# EAGLE design vfd_dcbus (EAGLE 9.6.1)
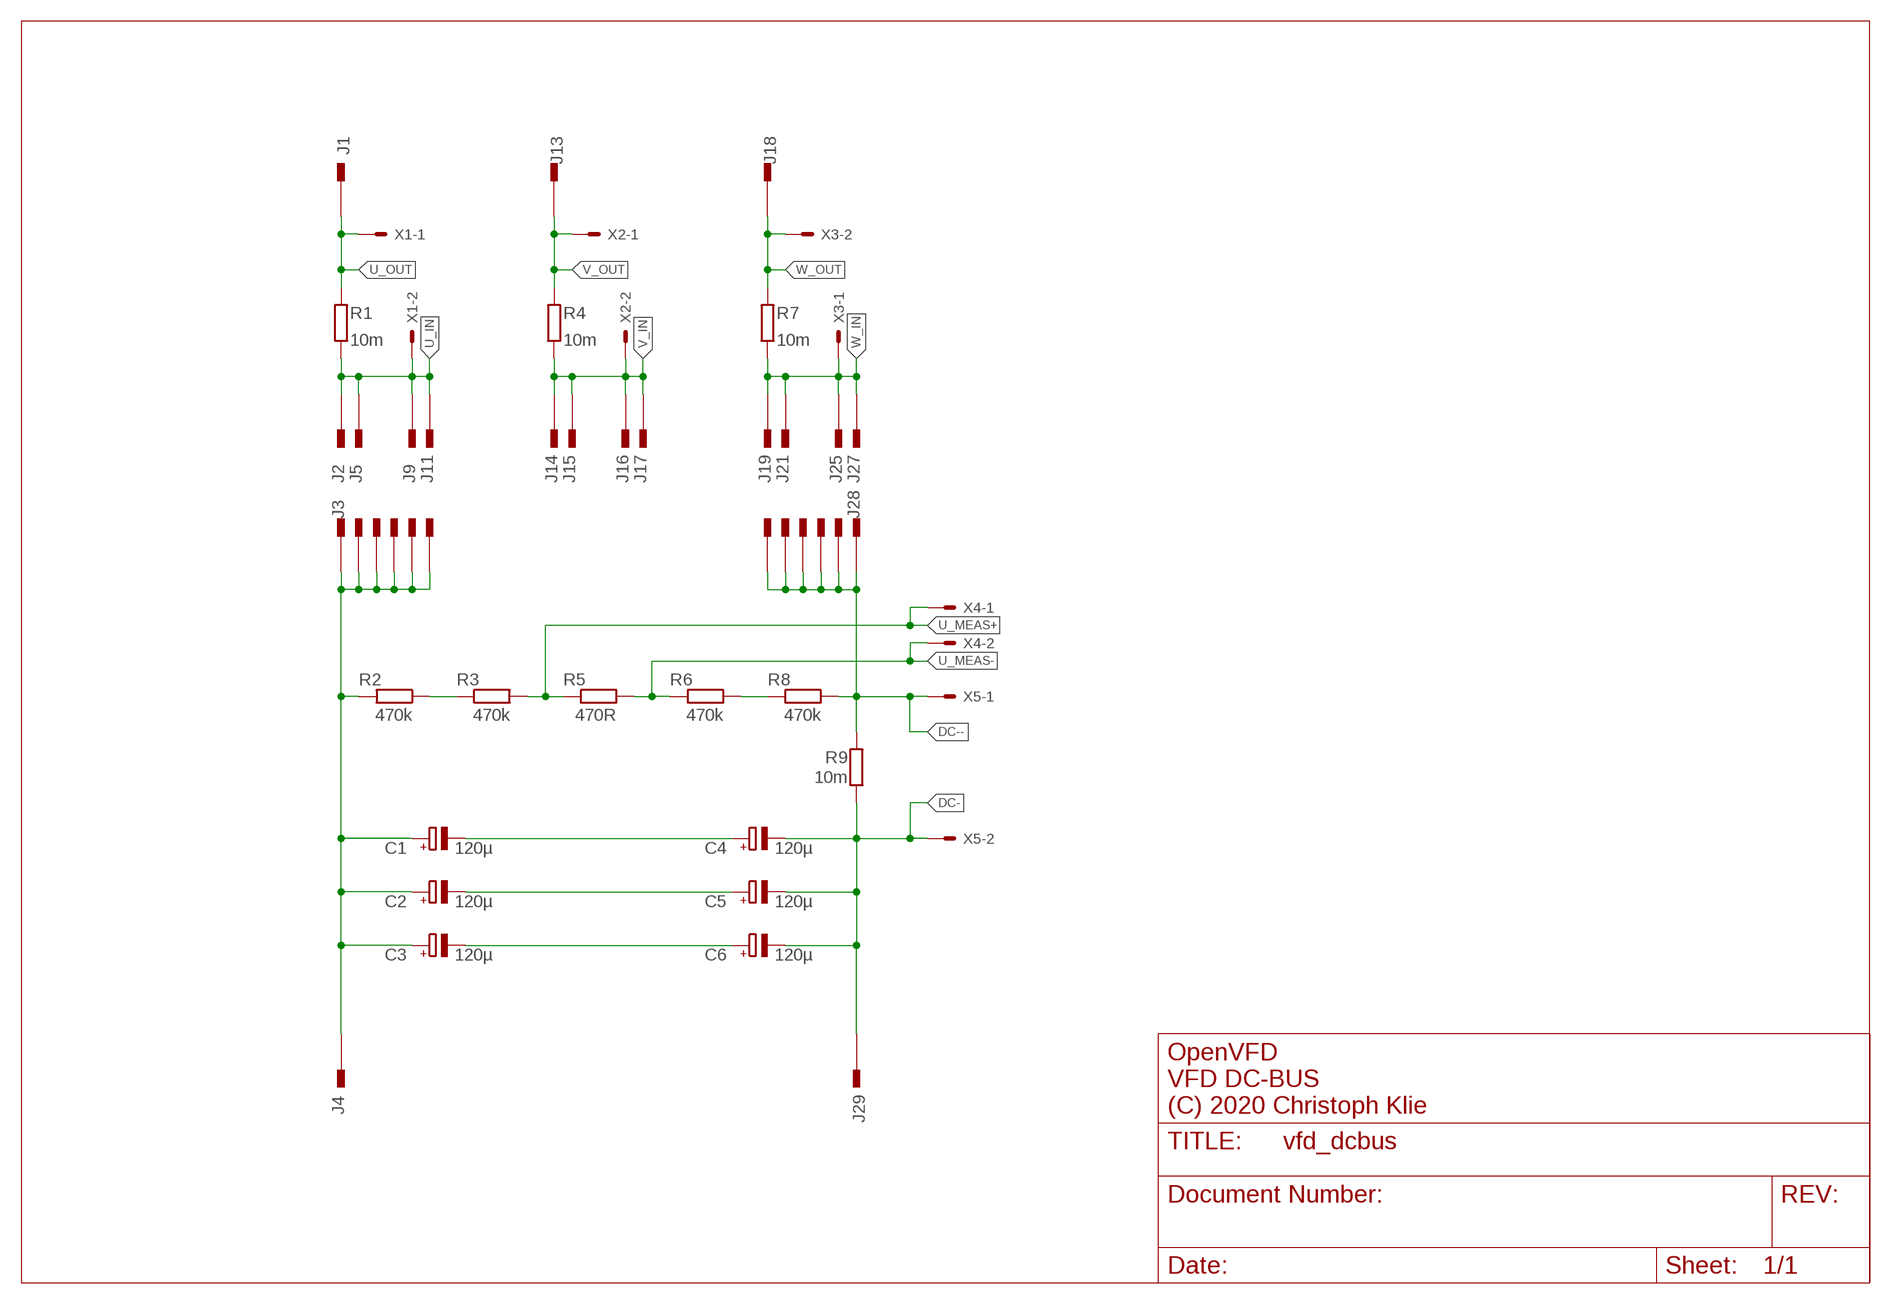
[diagram p0: schematic, sheet 1]

## Parts
C1  120µ  CPOL-EUE10-25  [EB25D]
C2  120µ  CPOL-EUE10-25  [EB25D]
C3  120µ  CPOL-EUE10-25  [EB25D]
C4  120µ  CPOL-EUE10-25  [EB25D]
C5  120µ  CPOL-EUE10-25  [EB25D]
C6  120µ  CPOL-EUE10-25  [EB25D]
J1  PIN2F061.200  [F061.200]
J2  PIN2F061.080  [F061.080]
J3  PIN2F061.080  [F061.080]
J4  PIN2F061.200  [F061.200]
J5  PIN2F061.080  [F061.080]
J6  PIN2F061.080  [F061.080]
J7  PIN2F061.080  [F061.080]
J8  PIN2F061.080  [F061.080]
J9  PIN2F061.080  [F061.080]
J10  PIN2F061.080  [F061.080]
J11  PIN2F061.080  [F061.080]
J12  PIN2F061.080  [F061.080]
J13  PIN2F061.200  [F061.200]
J14  PIN2F061.080  [F061.080]
J15  PIN2F061.080  [F061.080]
J16  PIN2F061.080  [F061.080]
J17  PIN2F061.080  [F061.080]
J18  PIN2F061.200  [F061.200]
J19  PIN2F061.080  [F061.080]
J20  PIN2F061.080  [F061.080]
J21  PIN2F061.080  [F061.080]
J22  PIN2F061.080  [F061.080]
J23  PIN2F061.080  [F061.080]
J24  PIN2F061.080  [F061.080]
J25  PIN2F061.080  [F061.080]
J26  PIN2F061.080  [F061.080]
J27  PIN2F061.080  [F061.080]
J28  PIN2F061.080  [F061.080]
J29  PIN2F061.200  [F061.200]
R1  10m  R-EU_R2512  [R2512]
R2  470k  R-EU_0207/5V  [0207/5V]
R3  470k  R-EU_0207/5V  [0207/5V]
R4  10m  R-EU_R2512  [R2512]
R5  470R  R-EU_R1206  [R1206]
R6  470k  R-EU_0207/5V  [0207/5V]
R7  10m  R-EU_R2512  [R2512]
R8  470k  R-EU_0207/5V  [0207/5V]
R9  10m  R-EU_R2512  [R2512]
X1  JST-XH-02-PIN-LONG-PAD  [JST-XH-02-PACKAGE-LONG-PAD]
X2  JST-XH-02-PIN-LONG-PAD  [JST-XH-02-PACKAGE-LONG-PAD]
X3  JST-XH-02-PIN-LONG-PAD  [JST-XH-02-PACKAGE-LONG-PAD]
X4  JST-XH-02-PIN-LONG-PAD  [JST-XH-02-PACKAGE-LONG-PAD]
X5  JST-XH-02-PIN-LONG-PAD  [JST-XH-02-PACKAGE-LONG-PAD]

## Nets
DC+: C1.+ C2.+ C3.+ J3.1A J3.1B J4.1A J4.1B J6.1A J6.1B J7.1A J7.1B J8.1A J8.1B J10.1A J10.1B J12.1A J12.1B R2.2
DC-: C4.- C5.- C6.- J29.1A J29.1B R9.1 X5.2
DC--: J20.1A J20.1B J22.1A J22.1B J23.1A J23.1B J24.1A J24.1B J26.1A J26.1B J28.1A J28.1B R8.2 R9.2 X5.1
N$1: R2.1 R3.1
N$2: R6.1 R8.1
N$8: C1.- C4.+
N$9: C2.- C5.+
N$10: C3.- C6.+
U_IN: J2.1A J2.1B J5.1A J5.1B J9.1A J9.1B J11.1A J11.1B R1.1 X1.2
U_MEAS+: R3.2 R5.1 X4.1
U_MEAS-: R5.2 R6.2 X4.2
U_OUT: J1.1A J1.1B R1.2 X1.1
V_IN: J14.1A J14.1B J15.1A J15.1B J16.1A J16.1B J17.1A J17.1B R4.1 X2.2
V_OUT: J13.1A J13.1B R4.2 X2.1
W_IN: J19.1A J19.1B J21.1A J21.1B J25.1A J25.1B J27.1A J27.1B R7.1 X3.1
W_OUT: J18.1A J18.1B R7.2 X3.2

## Notes on the sheet
- OpenVFD
- VFD DC-BUS
- (C) 2020 Christoph Klie

## Library data of the parts
C1-C6 = resistor:CPOL-EU: POLARIZED CAPACITOR, European symbol; R: BE LXS 120/450
J1 J4 J13 J18 J29 = con-faston:PIN2: Flachstecker Typ Tyco/Electronics/AMP TAB, FASTON Printed Circuit Board Tabs Source: http://www.buerklin.com, http://catalog.tycoelectronics.com; OC_FARNELL: unknown; OC_NEWARK: unknown; R: VT FS-PW 6,35
J2 J3 J5-J12 J14-J17 J19-J28 = con-faston:PIN2: Flachstecker Typ Tyco/Electronics/AMP TAB, FASTON Printed Circuit Board Tabs Source: http://www.buerklin.com, http://catalog.tycoelectronics.com; OC_FARNELL: unknown; OC_NEWARK: unknown; R: VT FS-P 6,35
R1 R4 R7 R9 = resistor:R-EU_: RESISTOR, European symbol; R: ISA SMT R010-1
R2 R3 R6 R8 = rcl:R-EU_: RESISTOR, European symbol; R: MPR 470K; SPICEPREFIX: R
R5 = rcl:R-EU_: RESISTOR, European symbol; R: SPR-1206 470; SPICEPREFIX: R
X1-X5 =  JST_XH_connnectors:JST-XH-02-PIN: JST XH Connector 2 Pin Wire to board connector. Pitch: 2,54 mm, (0.100") Number of pins: 2 Created by Rembrandt Electronics www.rembrandtelectronics.com; R: JST XH2P ST

## Board
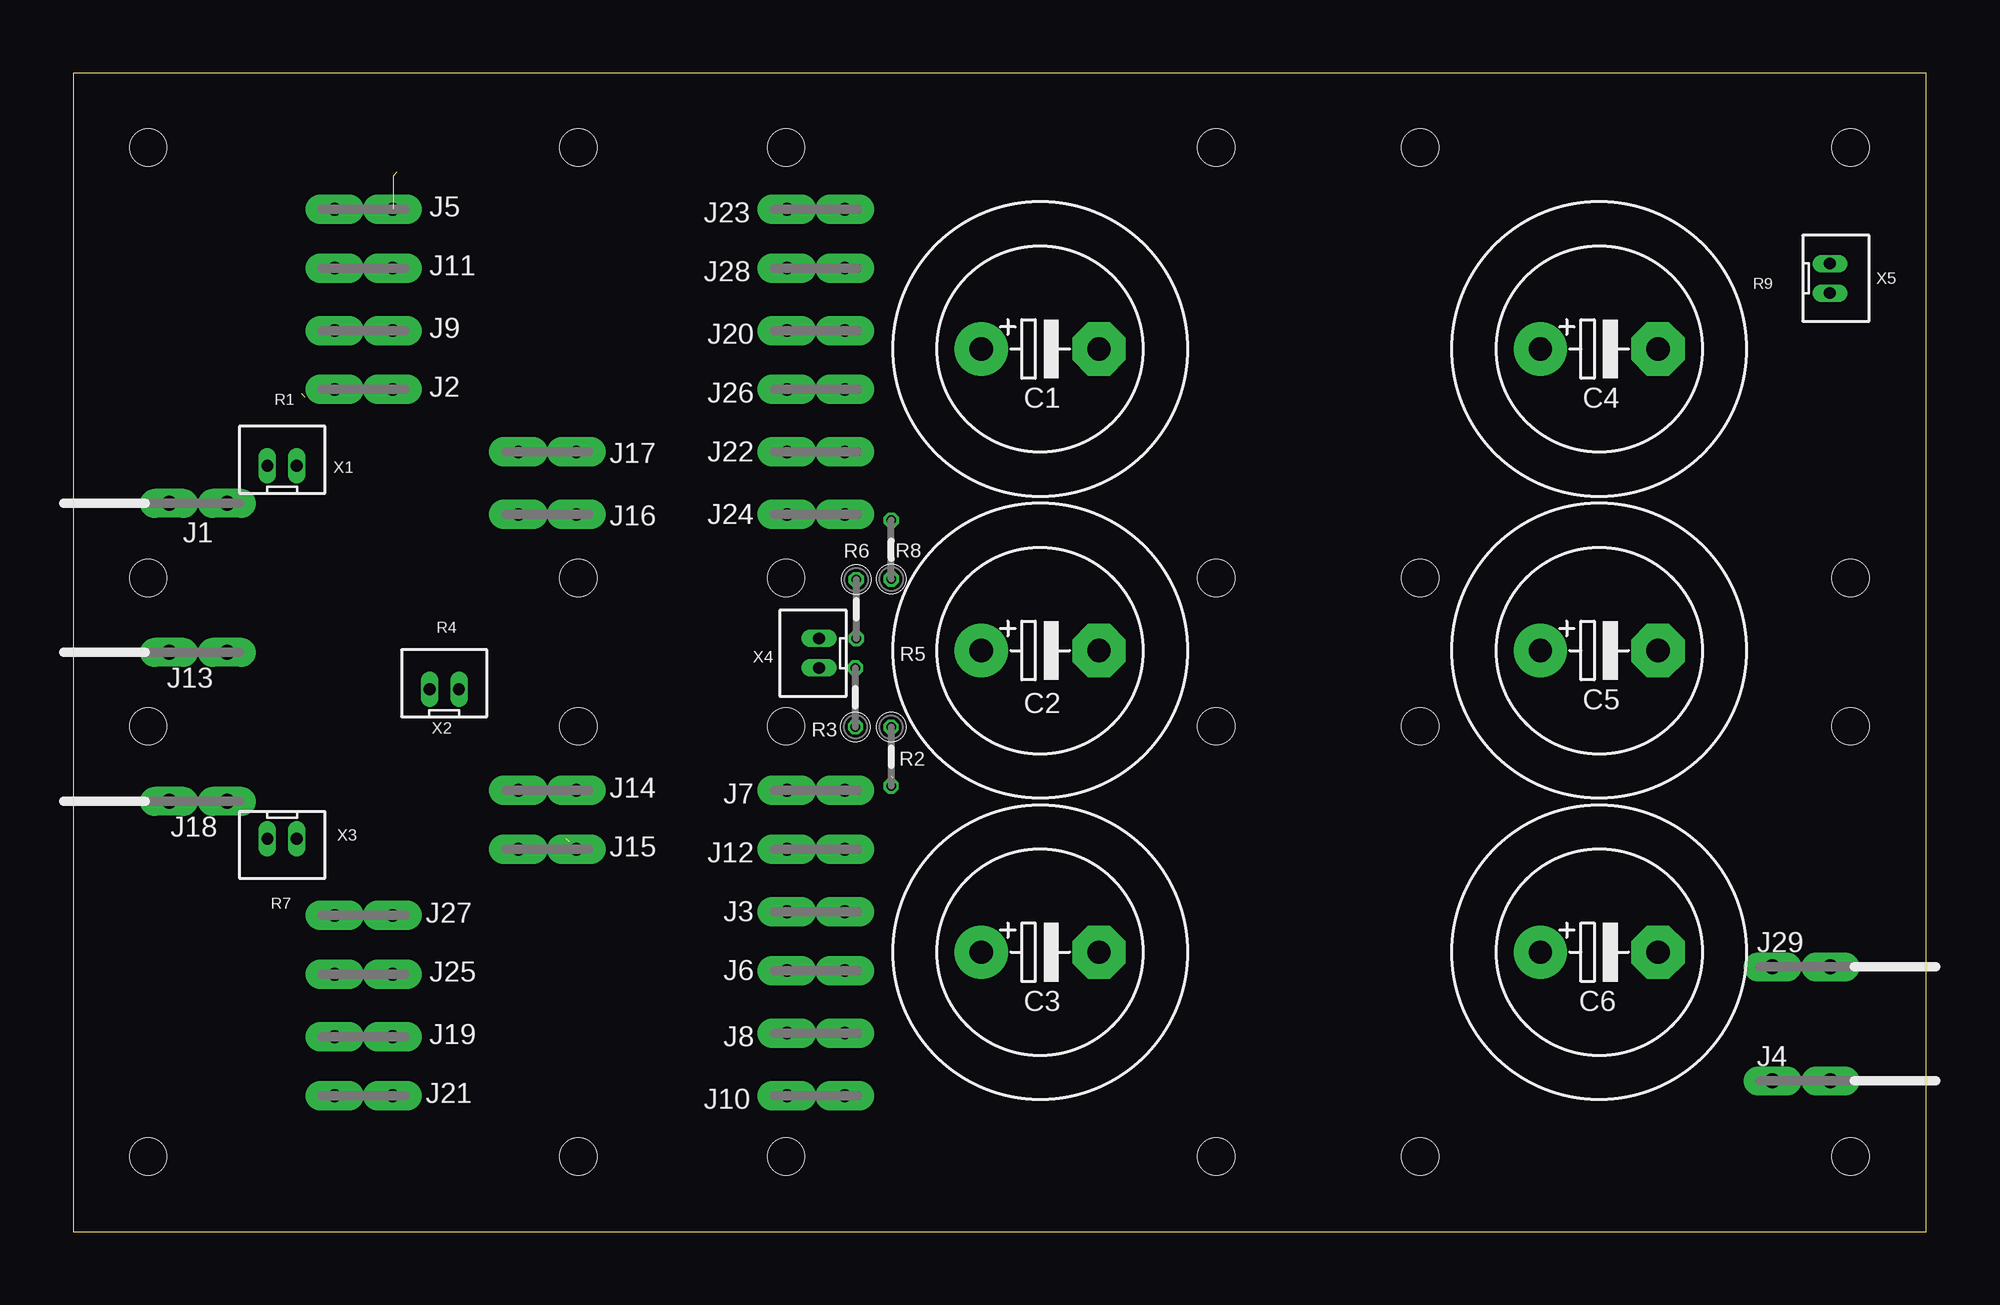
[diagram p1: board, top side]
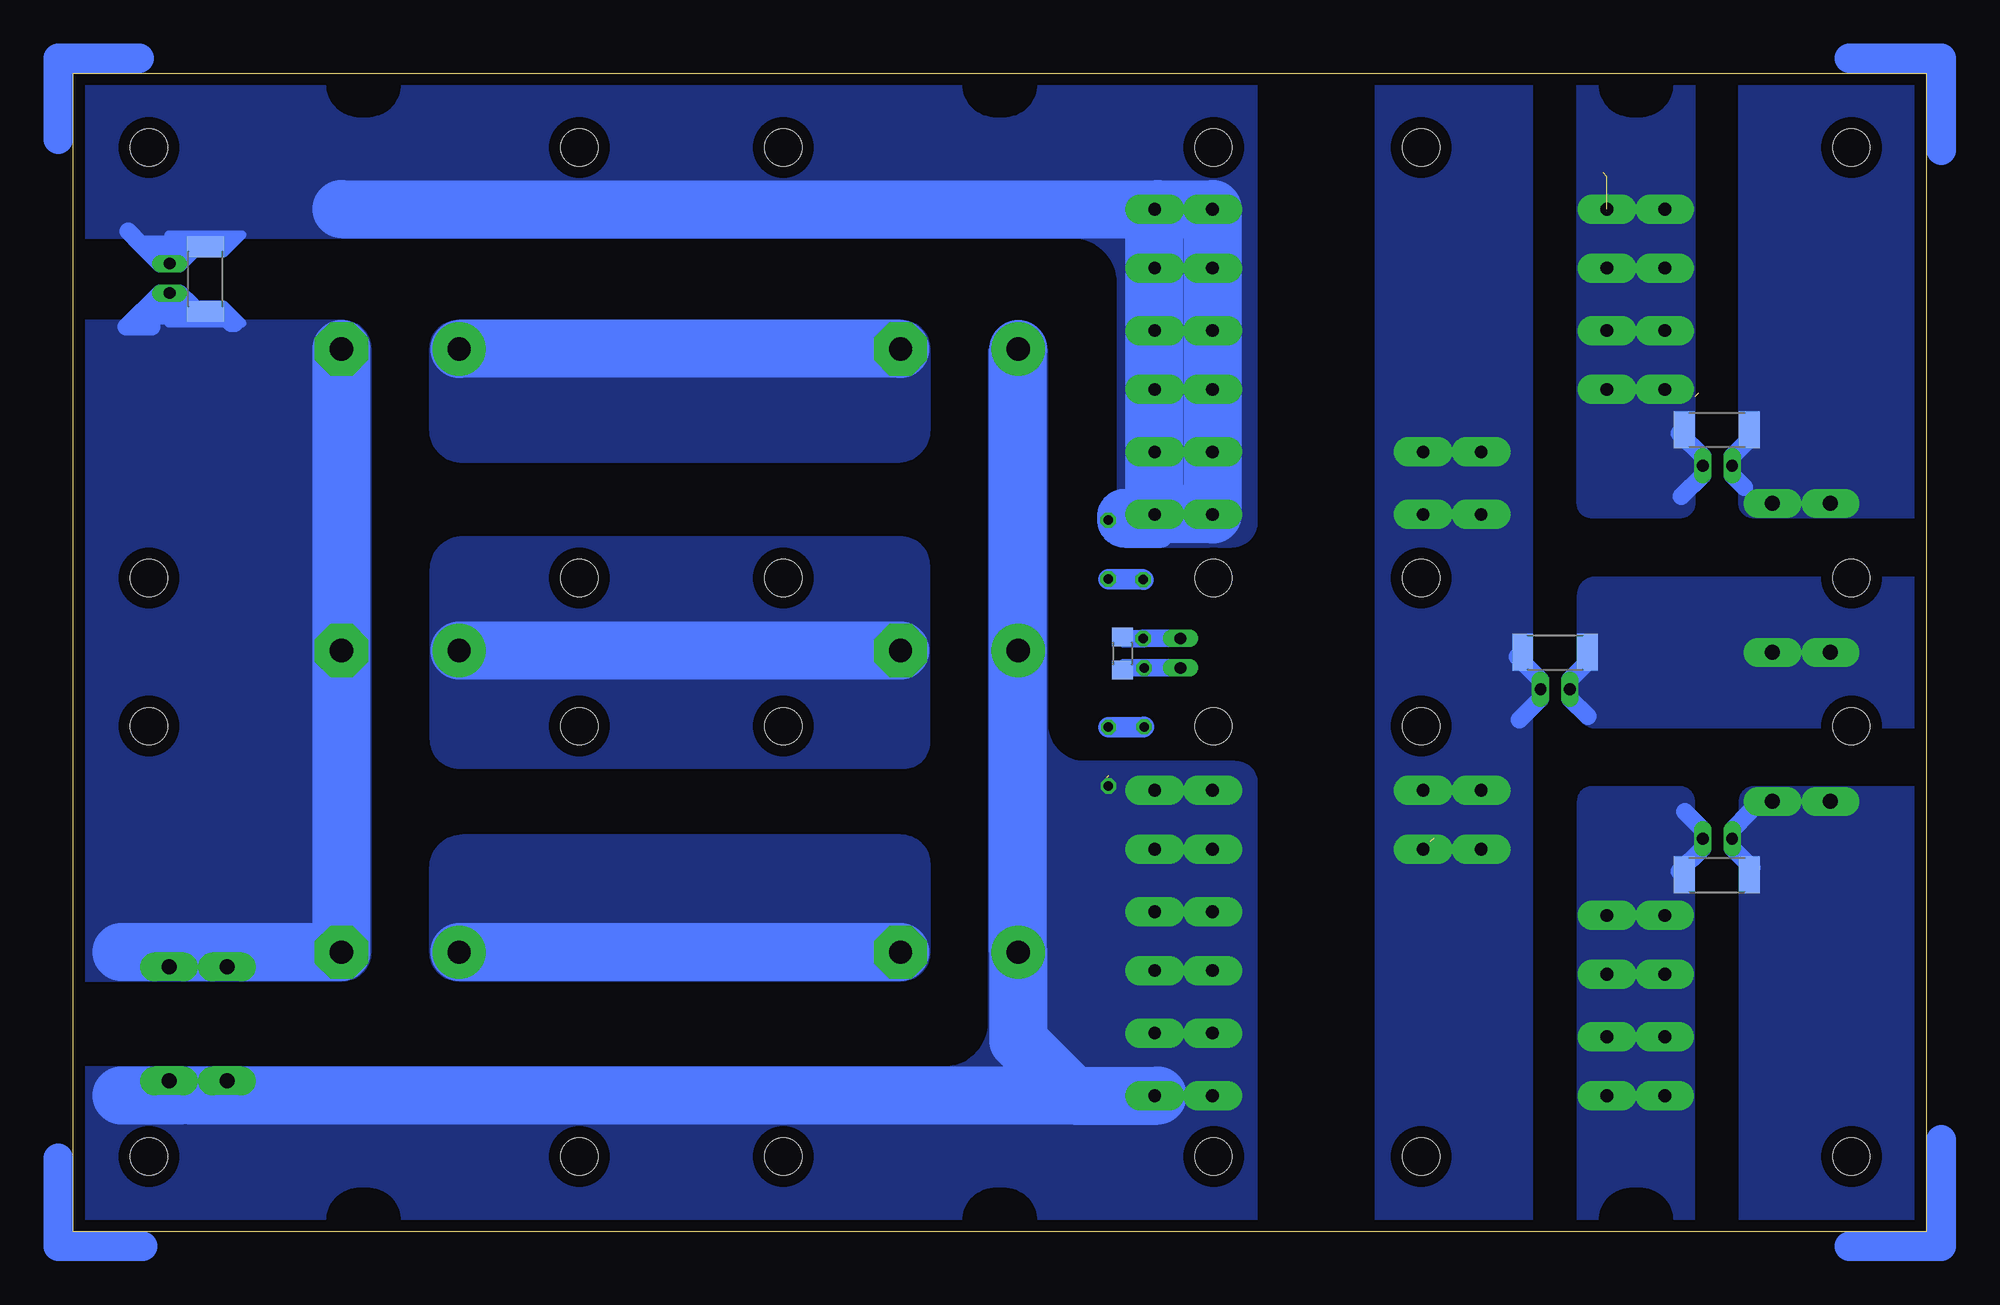
[diagram p2: board, bottom side, seen from below]

Size 160 x 100 mm. Coordinates in mm from the lower left corner, seen from the top.
Outline: 0,0 160,0 160,100 0,100 0,0
Copper layers (1*16): Top 0.035mm / dielectric 1.5mm / Bottom 0.035mm
Design rules "default": minimum track width 6mil, minimum drill 0.35mm, track to track 6mil, track to pad 6mil, pad to pad 6mil, via to via 6mil, smd to smd 6mil, copper to edge 40mil, drill to drill 6mil, minimum pad ring 10mil, minimum via ring 8mil, stop-mask expansion 4mil, vias tented up to drill 0mil, thermal gap 10mil
Holes 3.2 mm at 6.48,93.58 6.48,56.44 43.62,93.58 43.62,56.44 6.48,43.64 6.48,6.5 43.62,43.64 43.62,6.5 116.31,93.58 116.31,56.44 153.46,93.58 153.46,56.44 116.31,43.64 116.31,6.5 153.46,43.64 153.46,6.5 61.55,93.58 61.55,56.44 98.7,93.58 98.7,56.44 61.55,43.64 61.55,6.5 98.7,43.64 98.7,6.5
bRestrict: area 76.8,96.2 to 83.2,99.1; area 21.9,96.2 to 28.3,99.1; area 131.8,96.2 to 138.1,99.1; area 21.9,1 to 28.3,3.8; area 76.8,1 to 83.2,3.8; area 131.8,1 to 138.1,3.8
Milling: 5 lines

### Footprints (pad centres in the part's own frame; a part is rotated, then mirrored left to right if it is on the bottom)
EB25D = drill 2.007 pad 4.597: + -5.08,0 | drill 2.007 pad 4.597 octagon: - 5.08,0
F061.200 = drill 1.3 pad 2.5 long: 1A -2.5,0; 1B 2.5,0
F061.080 = drill 1.1 pad 2.54 long: 1A -2.5,0; 1B 2.5,0
R2512 = smd 1.8 x 3.2: 1 -2.8,0; 2 2.8,0
0207/5V = drill 0.813 octagon: 1 -2.54,0; 2 2.54,0
R1206 = smd 1.6 x 1.803: 1 -1.422,0; 2 1.422,0
JST-XH-02-PACKAGE-LONG-PAD = drill 1.016 long: 1 -1.27,0; 2 1.27,0

### Placement (x,y rotation side)
C1  83.5,76.2 0 top
C2  83.5,50.16 0 top
C3  83.5,24.13 0 top
C4  131.76,76.2 0 top
C5  131.76,50.16 0 top
C6  131.76,24.13 0 top
J1  10.79,62.87 180 top
J2  25.08,72.71 0 top
J3  64.14,27.62 180 top
J4  149.22,13.02 0 top
J5  25.08,88.27 180 top
J6  64.14,22.54 180 top
J7  64.14,38.1 180 top
J8  64.14,17.14 180 top
J9  25.08,77.79 180 top
J10  64.14,11.75 180 top
J11  25.08,83.19 180 top
J12  64.14,33.02 180 top
J13  10.79,50 180 top
J14  40.96,38.1 0 top
J15  40.96,33.02 0 top
J16  40.96,61.91 0 top
J17  40.96,67.31 180 top
J18  10.79,37.15 180 top
J19  25.08,16.83 0 top
J20  64.14,77.79 180 top
J21  25.08,11.75 180 top
J22  64.14,67.31 180 top
J23  64.14,88.27 180 top
J24  64.14,61.91 180 top
J25  25.08,22.23 180 top
J26  64.14,72.71 180 top
J27  25.08,27.3 180 top
J28  64.14,83.19 180 top
J29  149.22,22.86 0 top
R1  18.1,69.22 0 bottom
R2  70.63,41.01 270 top
R3  67.55,46.12 90 top
R4  32.07,50 0 bottom
R5  69.43,49.93 90 bottom
R6  67.62,53.75 270 top
R7  18.1,30.8 0 bottom
R8  70.63,58.88 90 top
R9  148.59,82.23 90 bottom
U$1  [A4L-LOC]  -48.26,-41.59 0 top  (outside the outline)
X1  18.05,66.12 0 top
X2  32.05,46.83 0 top
X3  18.05,33.92 180 top
X4  64.41,49.94 90 top
X5  151.69,82.3 270 top

### Tracks (layer width: path | path; a pad name or v marks a point on that pad's centre or on a via)
DC+
  Bottom 0.152: 78.42,16.51 78.42,16.19
  Bottom 1: 66.67,38.14 J7.1A
  Bottom 5: C1.+ C3.+ 78.42,16.51 73.66,11.75 | 73.66,11.75 149.86,11.75 | 150.85,11.75 155.85,11.75 | 73.66,11.75 66.36,11.75
  pour Bottom (no thermals): 59.69,40.64 arc90 57.78,38.73 57.78,0 160.02,0 160.02,14.29 84.77,14.29 arc-90 80.96,18.1 80.96,76.2 75.88,76.2 75.88,43.81 arc-90 72.71,40.64
DC-
  Bottom 0.75: 150.18,80.01 151.76,78.42 146.05,78.42 145.41,78.42 147,80.01 149.82,80.01 150.18,80.01 | X5.2 150.67,80.01 150.18,80.01
  Bottom 1.524: 149.82,80.01 150.84,81.03 X5.2 152.49,81.03 155.42,78.1 153.24,78.1 | R9.1 152.31,80.12 153.04,79.39 | 153.04,79.39 153.71,78.72 | 146.05,78.42 146.37,78.42 147,79.06 152.72,79.06 153.04,79.39
  Bottom 5: C4.- C6.- 155.85,24.13
  pour Bottom (no thermals): 160.02,78.74 136.84,78.74 arc90 134.3,76.2 134.3,24.13 arc90 136.84,21.59 160.02,21.59
DC--
  Bottom 0.75: 146.05,85.41 147,84.45 150.18,84.45 | 146.05,85.41 145.41,86.04 151.76,86.04 151.13,85.41 | 151.13,85.41 150.18,84.45 | 146.05,85.41 149.04,85.41 151.13,85.41 | 151,84.26 150.8,84.45 150.18,84.45
  Bottom 1: 136.84,86.62 136.84,88.27 136.84,88.9 | 66.67,61.87 J24.1A | 69.22,60.96 68.9,60.96
  Bottom 1.524: X5.1 150.88,83.57 149.04,85.41 | X5.1 152.49,83.57 154.18,85.25 | 155.26,86.34 154.18,85.25 | 154.18,85.25 152.78,85.25 | 152.78,85.25 152,85.25 151,84.26 | 152.78,85.25 151.69,84.17 X5.1
  Bottom 1.75: R8.2 67.13,61.42 J24.1A
  Bottom 1.905: 66.04,60.01 69.22,60.01 arc90 R8.2 70.63,61.76 arc90 69.22,63.18
  Bottom 5: 136.84,88.27 66.36,88.27 | 66.36,88.27 J23.1B J24.1B J24.1A 66.64,87.99 66.36,88.27
  pour Bottom (no thermals): 160.02,100.01 57.78,100.01 57.78,61.28 arc90 60.01,59.05 67.31,59.05 arc90 69.85,61.59 69.85,81.92 arc-90 73.66,85.72 160.02,85.72
N$1
  Bottom 1.778: R3.1 67.58,43.55 R2.1
N$2
  Bottom 1.75: R6.1 67.67,56.34 R8.1
N$3
  Bottom 2.54: -1.27,93.34 -1.27,101.28 6.67,101.28
N$4
  Bottom 2.54: 154.31,101.28 161.29,101.28 161.29,94.3
N$5
  Bottom 2.54: 161.29,6.35 161.29,-1.27 153.99,-1.27
N$6
  Bottom 2.54: -1.27,7.94 -1.27,-1.27 6.67,-1.27
N$8
  Bottom 5: C1.- C4.+
  pour Bottom (no thermals): 88.58,78.74 arc90 86.04,76.2 86.04,69.22 arc90 88.9,66.36 126.36,66.36 arc90 129.22,69.22 129.22,76.2 arc90 126.68,78.74
N$9
  Bottom 5: C2.- C5.+
  pour Bottom (no thermals): 93.03,60.01 126.36,60.01 arc-90 129.22,57.15 129.22,42.55 arc-90 126.68,40.01 88.27,40.01 arc-90 86.04,42.23 86.04,43.18 86.04,57.47 arc-90 88.58,60.01
N$10
  Bottom 5: C3.- C6.+
  pour Bottom (no thermals): 126.36,34.29 88.58,34.29 arc90 86.04,31.75 86.04,24.13 arc90 88.58,21.59 126.68,21.59 arc90 129.22,24.13 129.22,31.43 arc90
U_IN
  Bottom 1.524: 21.16,63.48 19.32,65.32 X1.2 19.32,66.92 21.31,68.92
  pour Bottom (no thermals): 20,65.41 20,62.87 arc90 21.27,61.59 28.89,61.59 arc90 30.16,62.87 30.16,100.01 20.64,100.01 20,100.01 20,89.53
U_MEAS+
  Bottom 1.524: X4.1 R3.2 arc-90 R3.2 69.27,48.66 arc-90 R5.1
U_MEAS-
  Bottom 1.524: X4.2 R6.2 arc-90 R6.2 69.28,51.21 arc90 R5.2
U_OUT
  Bottom 1.524: 15.71,64.25 16.78,65.32 X1.1 16.78,66.92 15.25,68.45
  pour Bottom (no thermals): 0,61.59 14.92,61.59 arc90 16.19,62.87 16.19,100.01 0,100.01
V_IN
  Bottom 1.524: 35.32,49.63 33.32,47.63 X2.2 33.32,46.02 35.16,44.18
  pour Bottom (no thermals): 33.97,0 33.97,100.01 47.62,100.01 47.62,0
V_OUT
  Bottom 1.524: 29.25,44.49 30.78,46.02 X2.1 30.78,47.63 29.09,49.32
  pour Bottom (no thermals): 0,56.52 28.57,56.52 arc-90 30.16,54.93 30.16,45.09 arc-90 28.57,43.5 0,43.5
W_IN
  Bottom 1.524: 21.31,31.11 19.32,33.11 X3.1 19.32,34.72 20.85,36.25
  pour Bottom (no thermals): 20,0 20,37.15 arc-90 21.27,38.42 28.89,38.42 arc-90 30.16,37.15 30.16,0
W_OUT
  Bottom 1.524: 15.09,31.43 16.78,33.11 X3.2 16.78,34.72 15.25,36.25
  pour Bottom (no thermals): 0,38.42 14.92,38.42 arc-90 16.19,37.15 16.19,0 0,0
(copper drawn outside any net)
  shapes: Bottom circle x24

### Text on the board
Document: OpenVFD | DC-BUS | (C) 2019 Christoph Klie | Version 1.0 | [1/1]